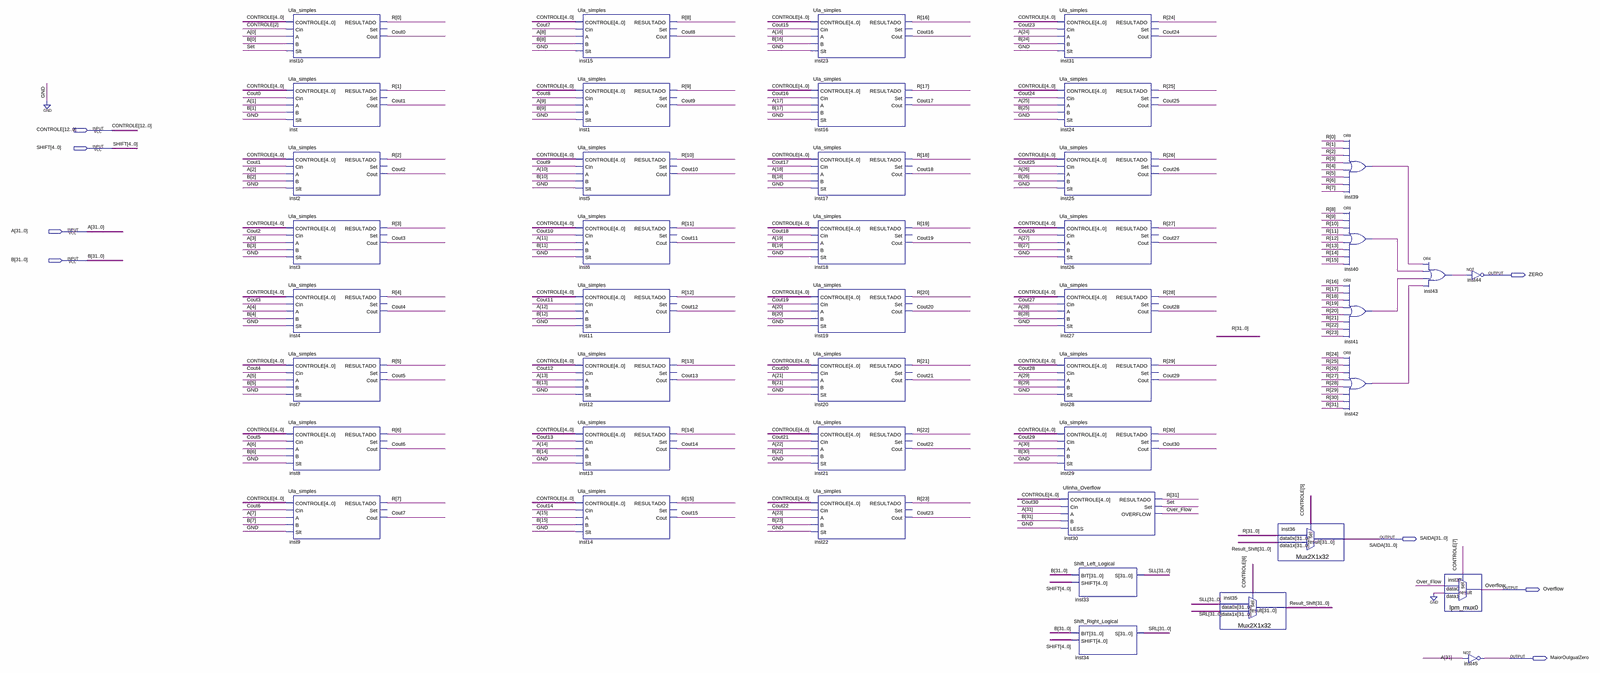
[diagram p0: schematic sheet, whole]
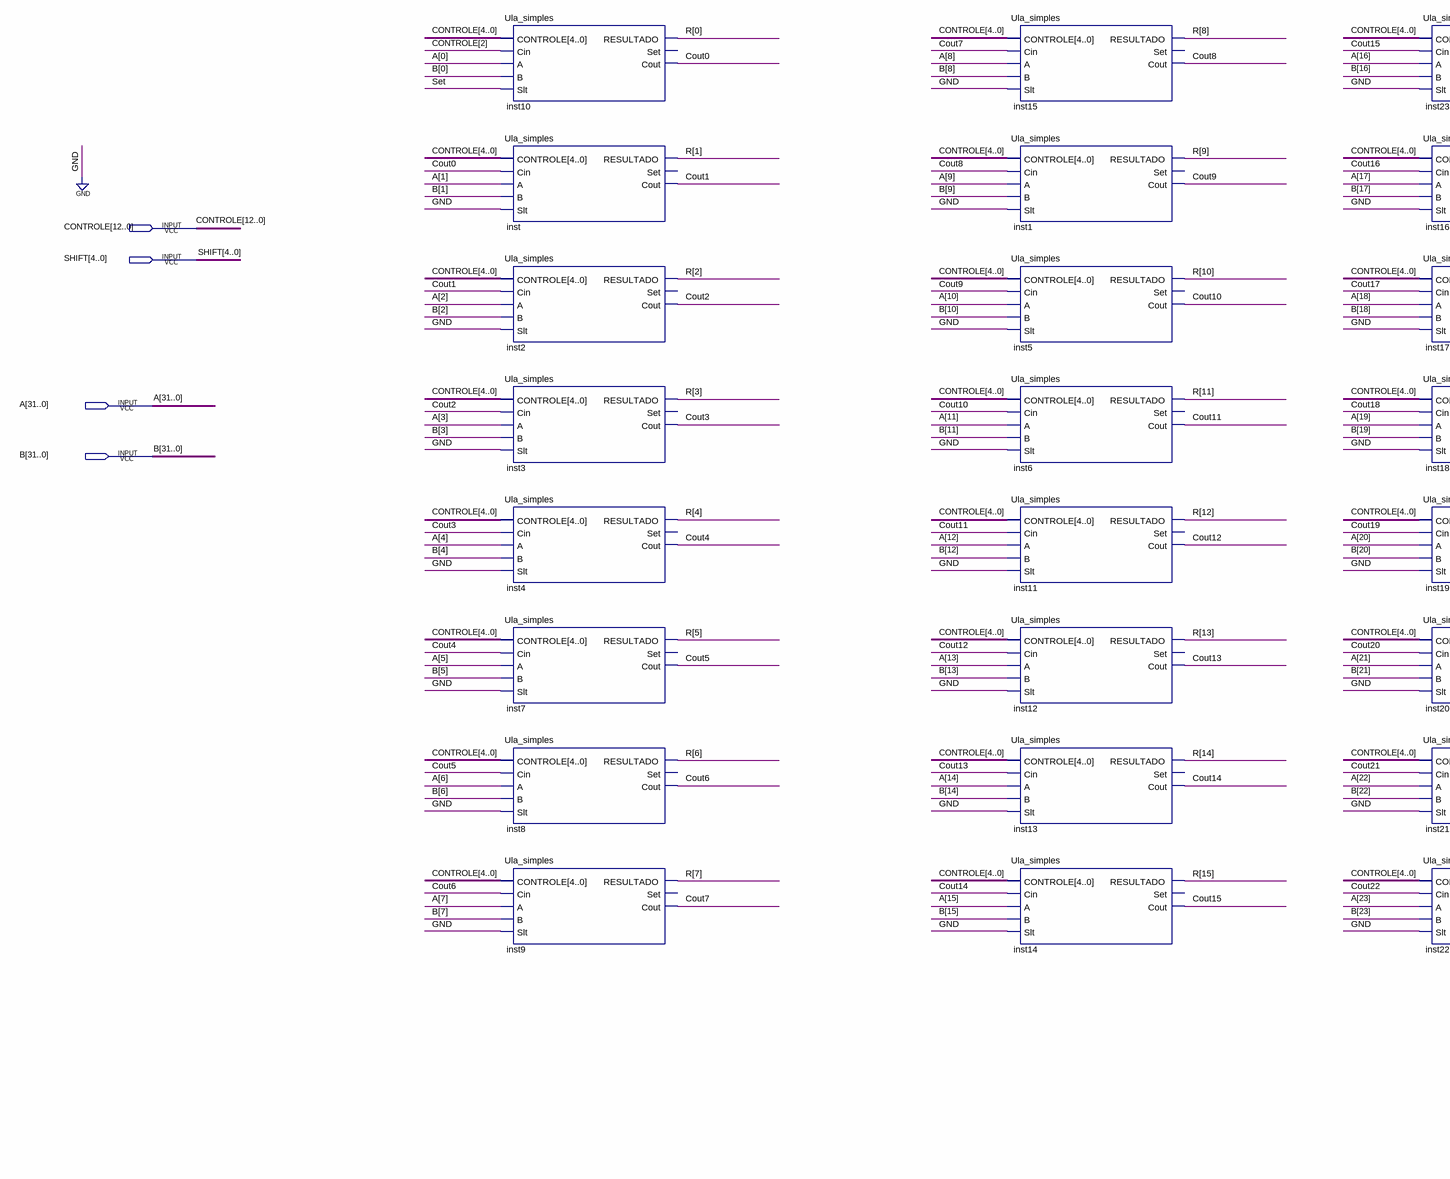
[diagram p1: schematic sheet, left part]
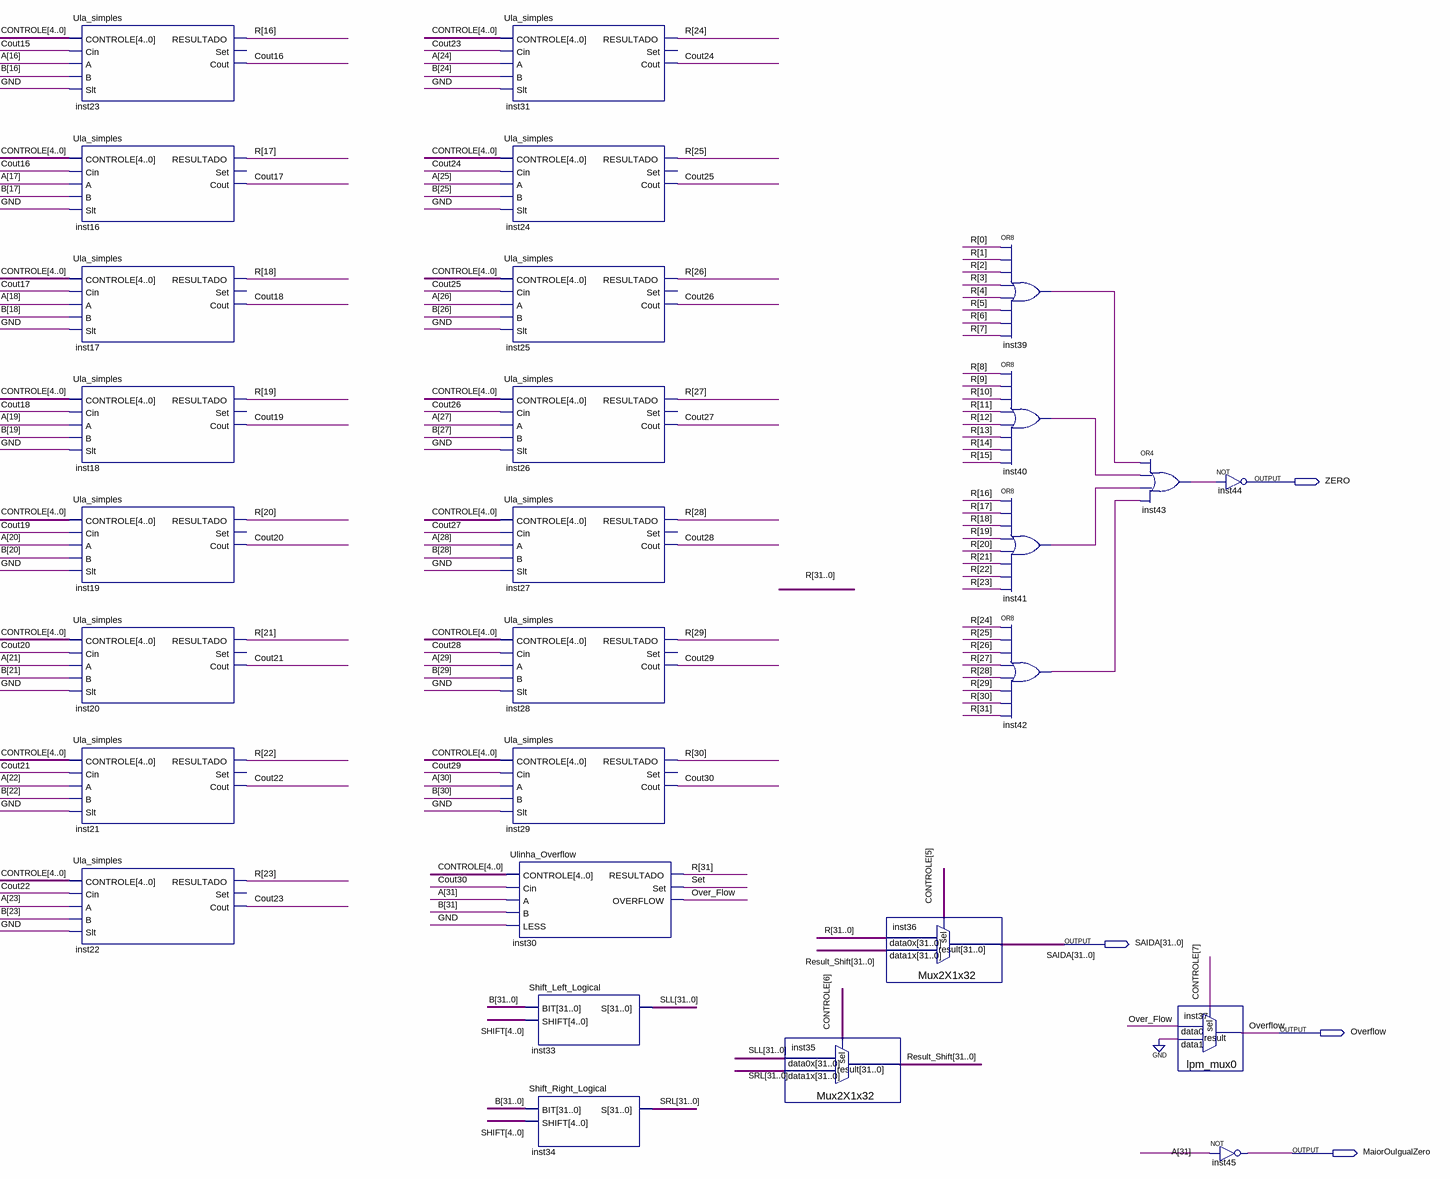
[diagram p2: schematic sheet, right part]
// Quartus schematic Ula_Completa.bdf as structural Verilog: 44 symbols, 8 pins
module Ula_Completa (
  input  [12:0] CONTROLE,
  input  [4:0] SHIFT,
  input  [31:0] A,
  input  [31:0] B,
  output ZERO,
  output [31:0] SAIDA,
  output Overflow,
  output MaiorOuIgualZero
);

  wire Cout0, Cout1, Cout2, Cout3, Cout4, Cout5, Cout6, Cout7, Cout8, Cout9, Cout10, Cout11, Cout12, Cout13,
       Cout14, Cout15, Cout16, Cout17, Cout18, Cout19, Cout20, Cout21, Cout22, Cout23, Cout24, Cout25,
       Cout26, Cout27, Cout28, Cout29, Cout30, inst39_out, inst40_out, inst41_out, inst42_out, inst43_out,
       Over_Flow, Set;
  wire [31:0] R, Result_Shift, SLL, SRL;

  Ula_simples inst10 (
    .CONTROLE(CONTROLE[4:0]), .Cin(CONTROLE[2]), .A(A[0]), .B(B[0]), .Slt(Set), .RESULTADO(R[0]), .Cout(Cout0));  // open: Set
  Ula_simples inst (
    .CONTROLE(CONTROLE[4:0]), .Cin(Cout0), .A(A[1]), .B(B[1]), .Slt(1'b0), .RESULTADO(R[1]), .Cout(Cout1));  // open: Set
  Ula_simples inst2 (
    .CONTROLE(CONTROLE[4:0]), .Cin(Cout1), .A(A[2]), .B(B[2]), .Slt(1'b0), .RESULTADO(R[2]), .Cout(Cout2));  // open: Set
  Ula_simples inst3 (
    .CONTROLE(CONTROLE[4:0]), .Cin(Cout2), .A(A[3]), .B(B[3]), .Slt(1'b0), .RESULTADO(R[3]), .Cout(Cout3));  // open: Set
  Ula_simples inst4 (
    .CONTROLE(CONTROLE[4:0]), .Cin(Cout3), .A(A[4]), .B(B[4]), .Slt(1'b0), .RESULTADO(R[4]), .Cout(Cout4));  // open: Set
  Ula_simples inst7 (
    .CONTROLE(CONTROLE[4:0]), .Cin(Cout4), .A(A[5]), .B(B[5]), .Slt(1'b0), .RESULTADO(R[5]), .Cout(Cout5));  // open: Set
  Ula_simples inst8 (
    .CONTROLE(CONTROLE[4:0]), .Cin(Cout5), .A(A[6]), .B(B[6]), .Slt(1'b0), .RESULTADO(R[6]), .Cout(Cout6));  // open: Set
  Ula_simples inst9 (
    .CONTROLE(CONTROLE[4:0]), .Cin(Cout6), .A(A[7]), .B(B[7]), .Slt(1'b0), .RESULTADO(R[7]), .Cout(Cout7));  // open: Set
  Ula_simples inst15 (
    .CONTROLE(CONTROLE[4:0]), .Cin(Cout7), .A(A[8]), .B(B[8]), .Slt(1'b0), .RESULTADO(R[8]), .Cout(Cout8));  // open: Set
  Ula_simples inst1 (
    .CONTROLE(CONTROLE[4:0]), .Cin(Cout8), .A(A[9]), .B(B[9]), .Slt(1'b0), .RESULTADO(R[9]), .Cout(Cout9));  // open: Set
  Ula_simples inst5 (
    .CONTROLE(CONTROLE[4:0]), .Cin(Cout9), .A(A[10]), .B(B[10]), .Slt(1'b0), .RESULTADO(R[10]), .Cout(Cout10));  // open: Set
  Ula_simples inst6 (
    .CONTROLE(CONTROLE[4:0]), .Cin(Cout10), .A(A[11]), .B(B[11]), .Slt(1'b0), .RESULTADO(R[11]), .Cout(Cout11));  // open: Set
  Ula_simples inst11 (
    .CONTROLE(CONTROLE[4:0]), .Cin(Cout11), .A(A[12]), .B(B[12]), .Slt(1'b0), .RESULTADO(R[12]), .Cout(Cout12));  // open: Set
  Ula_simples inst12 (
    .CONTROLE(CONTROLE[4:0]), .Cin(Cout12), .A(A[13]), .B(B[13]), .Slt(1'b0), .RESULTADO(R[13]), .Cout(Cout13));  // open: Set
  Ula_simples inst13 (
    .CONTROLE(CONTROLE[4:0]), .Cin(Cout13), .A(A[14]), .B(B[14]), .Slt(1'b0), .RESULTADO(R[14]), .Cout(Cout14));  // open: Set
  Ula_simples inst14 (
    .CONTROLE(CONTROLE[4:0]), .Cin(Cout14), .A(A[15]), .B(B[15]), .Slt(1'b0), .RESULTADO(R[15]), .Cout(Cout15));  // open: Set
  Ula_simples inst23 (
    .CONTROLE(CONTROLE[4:0]), .Cin(Cout15), .A(A[16]), .B(B[16]), .Slt(1'b0), .RESULTADO(R[16]), .Cout(Cout16));  // open: Set
  Ula_simples inst16 (
    .CONTROLE(CONTROLE[4:0]), .Cin(Cout16), .A(A[17]), .B(B[17]), .Slt(1'b0), .RESULTADO(R[17]), .Cout(Cout17));  // open: Set
  Ula_simples inst17 (
    .CONTROLE(CONTROLE[4:0]), .Cin(Cout17), .A(A[18]), .B(B[18]), .Slt(1'b0), .RESULTADO(R[18]), .Cout(Cout18));  // open: Set
  Ula_simples inst18 (
    .CONTROLE(CONTROLE[4:0]), .Cin(Cout18), .A(A[19]), .B(B[19]), .Slt(1'b0), .RESULTADO(R[19]), .Cout(Cout19));  // open: Set
  Ula_simples inst19 (
    .CONTROLE(CONTROLE[4:0]), .Cin(Cout19), .A(A[20]), .B(B[20]), .Slt(1'b0), .RESULTADO(R[20]), .Cout(Cout20));  // open: Set
  Ula_simples inst20 (
    .CONTROLE(CONTROLE[4:0]), .Cin(Cout20), .A(A[21]), .B(B[21]), .Slt(1'b0), .RESULTADO(R[21]), .Cout(Cout21));  // open: Set
  Ula_simples inst21 (
    .CONTROLE(CONTROLE[4:0]), .Cin(Cout21), .A(A[22]), .B(B[22]), .Slt(1'b0), .RESULTADO(R[22]), .Cout(Cout22));  // open: Set
  Ula_simples inst22 (
    .CONTROLE(CONTROLE[4:0]), .Cin(Cout22), .A(A[23]), .B(B[23]), .Slt(1'b0), .RESULTADO(R[23]), .Cout(Cout23));  // open: Set
  Ula_simples inst31 (
    .CONTROLE(CONTROLE[4:0]), .Cin(Cout23), .A(A[24]), .B(B[24]), .Slt(1'b0), .RESULTADO(R[24]), .Cout(Cout24));  // open: Set
  Ula_simples inst24 (
    .CONTROLE(CONTROLE[4:0]), .Cin(Cout24), .A(A[25]), .B(B[25]), .Slt(1'b0), .RESULTADO(R[25]), .Cout(Cout25));  // open: Set
  Ula_simples inst25 (
    .CONTROLE(CONTROLE[4:0]), .Cin(Cout25), .A(A[26]), .B(B[26]), .Slt(1'b0), .RESULTADO(R[26]), .Cout(Cout26));  // open: Set
  Ula_simples inst26 (
    .CONTROLE(CONTROLE[4:0]), .Cin(Cout26), .A(A[27]), .B(B[27]), .Slt(1'b0), .RESULTADO(R[27]), .Cout(Cout27));  // open: Set
  Ula_simples inst27 (
    .CONTROLE(CONTROLE[4:0]), .Cin(Cout27), .A(A[28]), .B(B[28]), .Slt(1'b0), .RESULTADO(R[28]), .Cout(Cout28));  // open: Set
  Ula_simples inst28 (
    .CONTROLE(CONTROLE[4:0]), .Cin(Cout28), .A(A[29]), .B(B[29]), .Slt(1'b0), .RESULTADO(R[29]), .Cout(Cout29));  // open: Set
  Ula_simples inst29 (
    .CONTROLE(CONTROLE[4:0]), .Cin(Cout29), .A(A[30]), .B(B[30]), .Slt(1'b0), .RESULTADO(R[30]), .Cout(Cout30));  // open: Set
  Ulinha_Overflow inst30 (
    .CONTROLE(CONTROLE[4:0]), .Cin(Cout30), .A(A[31]), .B(B[31]), .LESS(1'b0), .RESULTADO(R[31]), .Set(Set),
    .OVERFLOW(Over_Flow));
  Shift_Left_Logical inst33 (.BIT(B), .SHIFT(SHIFT), .S(SLL));
  Shift_Right_Logical inst34 (.BIT(B), .SHIFT(SHIFT), .S(SRL));
  Mux2X1x32 inst35 (.data1x(SRL), .data0x(SLL), .sel(CONTROLE[6]), .result(Result_Shift));
  Mux2X1x32 inst36 (.data1x(Result_Shift), .data0x(R), .sel(CONTROLE[5]), .result(SAIDA));
  or inst39 (inst39_out, R[0], R[1], R[2], R[3], R[4], R[5], R[6], R[7]);
  or inst40 (inst40_out, R[8], R[9], R[10], R[11], R[12], R[13], R[14], R[15]);
  or inst41 (inst41_out, R[16], R[17], R[18], R[19], R[20], R[21], R[22], R[23]);
  or inst42 (inst42_out, R[24], R[25], R[26], R[27], R[28], R[29], R[30], R[31]);
  or inst43 (inst43_out, inst39_out, inst40_out, inst41_out, inst42_out);
  lpm_mux0 inst37 (.data1(1'b0), .data0(Over_Flow), .sel(CONTROLE[7]), .result(Overflow));
  not inst44 (ZERO, inst43_out);
  not inst45 (MaiorOuIgualZero, A[31]);
endmodule
